# Altium schematic sheet CalibradorDePlacas_Microcontrolador.SchDoc
size A4
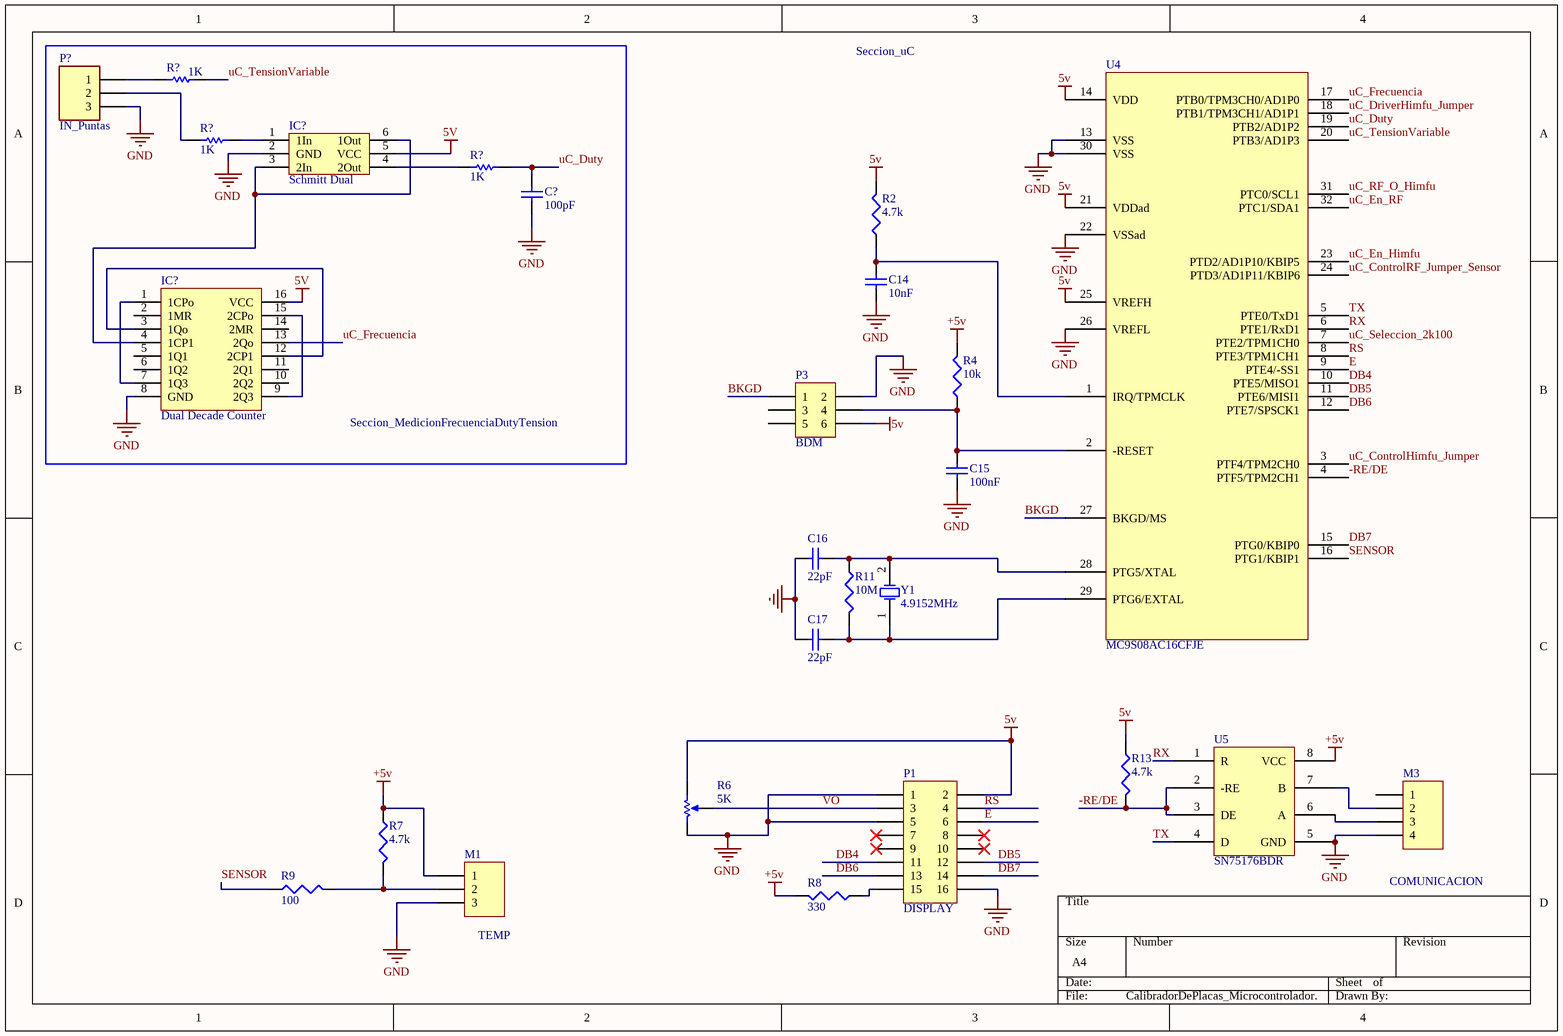
[diagram p0: CalibradorDePlacas_Microcontrolador.SchDoc]

## Parts
(Parts that share a designator on the sheet are numbered #1, #2 ... from top to bottom, then left to right.)
C14  10nF  [6-0805_M]
C15  100nF  [6-0805_M]
C16  22pF  [6-0805_M]
C17  22pF  [6-0805_M]
C?  100pF  [C_0805_3D]
IC?#1  Schmitt Dual  [TSOT23-6_3D]
IC?#2  Dual Decade Counter
M1  TEMP  [B3B-XH-A]
M3  COMUNICACION  [B4B-XH-A]
P1  DISPLAY  [HDR2X8]
P3  BDM  [SIP3*2]
P?  IN_Puntas  [B3B-XH-A_3D]
R2  4.7k  [6-0805_M]
R4  10k  [6-0805_M]
R6  5K  [PRESET 3386W]
R7  4.7k  [6-0805_M]
R8  330  [6-0805_M]
R9  100  [6-0805_M]
R11  10M  [6-0805_M]
R13  4.7k  [6-0805_M]
R?#1  1K  [R_0805_3D]
R?#2  1K  [R_0805_3D]
R?#3  1K  [R_0805_3D]
U4  MC9S08AC16CFJE  [QFP7x7-G32/Y1.45N]
U5  SN75176BDR  [SO8_L]
Y1  4.9152MHz  [XTAL_LOW]

## Blocks framed on the sheet
Seccion_MedicionFrecuenciaDutyTension: C? IC?#1 IC?#2 P? R?#1-R?#3

## Nets
5V: IC?#1.5(VCC) IC?#2.16(VCC) P1.2 P3.6 R2.2 R6.1(TOP) R13.1 U4.14(VDD) U4.21(VDDad) U4.25(VREFH)
+5v: M1.1 R4.2 R7.1 R8.2 U5.8(VCC)
GND: C14.1 C15.1 C16.1 C17.1 C?.1 IC?#1.2(GND) IC?#2.8(GND) M1.3 M3.4 P1.1 P1.5 P1.16 P3.2 P?.3 R6.3(BOT) U4.13(VSS) U4.22(VSSad) U4.26(VREFL) U4.30(VSS) U5.5(GND)
-RE/DE: R13.2 U4.4(PTF5/TPM2CH1) U5.2(-RE) U5.3(DE)
BKGD: P3.1 U4.27(BKGD/MS)
DB4: P1.11 U4.10(PTE5/MISO1)
DB5: P1.12 U4.11(PTE6/MISI1)
DB6: P1.13 U4.12(PTE7/SPSCK1)
DB7: P1.14 U4.15(PTG0/KBIP0)
E: P1.6 U4.9(PTE4/-SS1)
RS: P1.4 U4.8(PTE3/TPM1CH1)
RX: U4.6(PTE1/RxD1) U5.1(R)
SENSOR: R9.1 U4.16(PTG1/KBIP1)
TX: U4.5(PTE0/TxD1) U5.4(D)
uC_ControlHimfu_Jumper: U4.3(PTF4/TPM2CH0)
uC_ControlRF_Jumper_Sensor: U4.24(PTD3/AD1P11/KBIP6)
uC_DriverHimfu_Jumper: U4.18(PTB1/TPM3CH1/AD1P1)
uC_Duty: C?.2 R?#3.1 U4.19(PTB2/AD1P2)
uC_En_Himfu: U4.23(PTD2/AD1P10/KBIP5)
uC_En_RF: U4.32(PTC1/SDA1)
uC_Frecuencia: IC?#2.13(2Qo) U4.17(PTB0/TPM3CH0/AD1P0)
uC_RF_O_Himfu: U4.31(PTC0/SCL1)
uC_Seleccion_2k100: U4.7(PTE2/TPM1CH0)
uC_TensionVariable: R?#1.2 U4.20(PTB3/AD1P3)
VO: P1.3 R6.2(TAP)
NetC14_2: C14.2 R2.1 U4.1(IRQ/TPMCLK)
NetC15_2: C15.2 P3.4 R4.1 U4.2(-RESET)
NetC16_2: C16.2 R11.1 U4.28(PTG5/XTAL) Y1.2(OSC2)
NetC17_2: C17.2 R11.2 U4.29(PTG6/EXTAL) Y1.1(OSC1)
NetIC?#1_1: IC?#1.1(1In) R?#2.1
NetIC?#1_3: IC?#1.3(2In) IC?#1.6(1Out) IC?#2.4(1CP1)
NetIC?#1_4: IC?#1.4(2Out) R?#3.2
NetIC?#2_1: IC?#2.1(1CPo) IC?#2.7(1Q3)
NetIC?#2_3: IC?#2.3(1Qo) IC?#2.12(2CP1)
NetIC?#2_9: IC?#2.9(2Q3) IC?#2.15(2CPo)
NetM1_2: M1.2 R7.2 R9.2
NetM3_2: M3.2 U5.7(B)
NetM3_3: M3.3 U5.6(A)
NetP1_15: P1.15 R8.1
NetP?_1: P?.1 R?#1.1
NetP?_2: P?.2 R?#2.2

Not connected (* = marked no-connect by the designer): IC?#2 2(1MR) 5(1Q1) 6(1Q2) 10(2Q2) 11(2Q1) 14(2MR); M3 1; P1 7* 8* 9* 10*; P3 3 5

## Notes on the sheet
- Seccion_uC

## Library data of the parts
C14 = Cap: CAP CER 10000PF 50V 10% X7R 0805; Cod.Fabricante: C0805C103K5RACTU; Fabricante: Kemet; PackageReference: 6-0805_M; PackageDescription: Radial Cap, Thru-Hole; 2 Leads; 0.3 in Pin Spacing; Value: 10nF; Cod.Digikey: 399-1158-1-ND
C15 = Cap: CAP CER 0.1UF 50V 10% X7R 0805; Cod.Fabricante: C0805C104K5RACTU; Fabricante: Kemet; PackageReference: 6-0805_M; PackageDescription: Radial Cap, Thru-Hole; 2 Leads; 0.3 in Pin Spacing; Value: 100nF; Cod.Digikey: 399-1170-1-ND
C16 C17 = Cap: CAP CER 22PF 50V 5% NP0 0805; Cod.Fabricante: C0805C220J5GACTU; Fabricante: Kemet; PackageReference: 6-0805_M; PackageDescription: Radial Cap, Thru-Hole; 2 Leads; 0.3 in Pin Spacing; Value: 22pF; Cod.Digikey: 399-1113-1-ND
C? = C_0805_3D: Ceramic Chip Capacitor - Standard; Note: Footprint corresponds to dimensions for bulk cassette packaging. This case size has tightened tolerances.; Published: 17-Jul-2002; LatestRevisionDate: 19-Mar-2004; LatestRevisionNote: Silkscreen size reduced.; DatasheetDocument: Mar-2001; PackageDocument: Mar-2001; PackageReference: 0805; Publisher: Altium Limited; Code_JEITA: 0805; Code_IPC: 2012[0805]; ComponentLink1Description: Manufacturer Link; ComponentLink1URL: http://www.kemet.com/; ComponentLink2Description: Datasheet; ComponentLink2URL: http://www.kemet.com/kemet/web/homepage/kechome.nsf/vapubfilesname/F3102TA.pdf/$file/F3102TA.pdf; Cod.Digikey: *; Cod.Fabricante: *; Fabricante: *; Value: 100pF; Px100: *; DIGIKEYx100: *
IC?#1 = SN74L14: Inverter IC 2 Channel Schmitt Trigger SOT-23-6; Cod.Fabricante: SN74LVC2G14DBVR; Fabricante: Texas Instruments; Cod.DigiKey: 296-13010-1-ND; ComponentLink1Description: Manufacturer Link; ComponentLink1URL: http://www.ti.com/lit/ds/symlink/sn74lvc2g14.pdf; ComponentLink2Description: Datasheet; ComponentLink2URL: *; DatasheetVersion: O; DIGIKEYx100: 0.18790; LatestRevisionDate: *; LatestRevisionNote: *; PackageDescription: SOT-23-6; PackageReference: SOT-23-6; PackageVersion: *; Published: 29-sep-00; Publisher: Altium Limited; Value: *
IC?#2 = CD74HC390: Counter IC Counter, Decade 2 Element 4 Bit Negative Edge 16-SOIC; Cod.Fabricante: CD74HC390M96; Fabricante: Texas Instruments; Cod.DigiKey: 296-14526-1-ND; ComponentLink1Description: Manufacturer Link; ComponentLink1URL: http://www.ti.com/general/docs/suppproductinfo.tsp?distId=10&gotoUrl=http%3A%2F%2Fwww.ti.com%2Flit%2Fgpn%2Fcd74hc390; ComponentLink2Description: Datasheet; ComponentLink2URL: *; DatasheetVersion: *; DIGIKEYx100: 0.44560; LatestRevisionDate: *; LatestRevisionNote: *; PackageDescription: 16-SOIC; PackageReference: 16-SOIC; PackageVersion: *; Published: 29-sep-00; Publisher: Altium Limited; Value: *
M1 = Header 3: 3 Positions Header, Shrouded Connector 0.098" (2.50mm) Through Hole Tin; Value: B3B-XH-A(LF)(SN); Fabricante: JST Sales America Inc.; PackageReference: HDR1X3; PackageDescription: Conector 3 pines Macho polarizado; Cod.Digikey: 455-2248-ND; Cod.Fabricante: B3B-XH-A(LF)(SN)
M3 = Header 4: 4 Positions Header, Shrouded Connector 0.098" (2.50mm) Through Hole Tin; Value: B4B-XH-A(LF)(SN); Fabricante: JST Sales America Inc.; PackageReference: HDR1X4; PackageDescription: Conector 4 pines Macho polarizado; Cod.Digikey: 455-2249-ND; Cod.Fabricante: B4B-XH-A(LF)(SN)
P1 = Header 8X2: CONN HEADER VERT 16POS 2.54MM; Cod.Fabricante: M20-9980845; Fabricante: Harwin Inc; Value: M20-9980845; LatestRevisionDate: 17-Jul-2002; Publisher: Altium Limited; Cod.Digikey: 952-2553-ND; PackageReference: HDR2X8
P3 = CON3*2: DIL VERTICAL PC TAIL PIN HEADER; Cod.Fabricante: M20-9980345; Fabricante: Harwin Inc; Value: M20-9980345; Cod.Digikey: 952-2120-ND
P? = JST_2.5_3: CONN HEADER XH TOP 3POS 2.5MM; Cod.Fabricante: B3B-XH-A(LF)(SN); Fabricante: JST Sales America Inc.; LatestRevisionDate: 17-Jul-2002; LatestRevisionNote: Re-released for DXP Platform.; Publisher: Altium Limited; Cod.Digikey: 455-2248-ND; ComponentLink2Description: Datasheet; ComponentLink2URL: http://www.jst-mfg.com/product/pdf/eng/eXH.pdf; DIGIKEYx100: 0.1115
R2 R7 R13 = Res3: RES SMD 4.7K OHM 1% 1/8W 0805; Cod.Fabricante: RC0805FR-074K7L; Fabricante: Yageo; PackageReference: 6-0805_M; PackageDescription: Chip Resistor; Value: 4.7k; Cod.Digikey: 311-4.70KCRCT-ND
R4 = Res3: RES SMD 10K OHM 1% 1/8W 0805; Cod.Fabricante: RC0805FR-0710KL; Fabricante: Yageo; PackageReference: 6-0805_M; PackageDescription: Chip Resistor; Value: 10k; Cod.Digikey: 311-10.0KCRCT-ND
R6 = RPot: TRIMMER 5K OHM 0.5W PC PIN; Sim Note: Enter the Resistance value and the set point into parameter fields.; Set Position: 0.5; Cod.Fabricante: 3362M-1-502LF; Fabricante: Bourns Inc.; Published: 8-Jun-2000; LatestRevisionDate: 17-Jul-2002; LatestRevisionNote: Re-released for DXP Platform.; PackageReference: VR5; Publisher: Altium Limited; Value: 5K; Cod.Digikey: 3362M-502LF-ND ó 3386W-502LF-ND
R8 = Res3: RES SMD 330 OHM 1% 1/8W 0805; Cod.Fabricante: RC0805FR-07330RL; Fabricante: Yageo; PackageReference: 6-0805_M; PackageDescription: Chip Resistor; Value: 330; Cod.Digikey: 311-330CRCT-ND
R9 = Res3: RES SMD 100 OHM 1% 1/8W 0805; Cod.Fabricante: RC0805FR-07100RL; Fabricante: Yageo; PackageReference: 6-0805_M; PackageDescription: Chip Resistor; Value: 100; Cod.Digikey: 311-100CRCT-ND
R11 = Res3: RC0805FR-0710ML; Fabricante: Yageo; PackageReference: 6-0805_M; PackageDescription: Chip Resistor; Value: 10M; Cod.Digikey: 311-10.0MCRCT-ND; Cod.Fabricante: RC0805FR-0710ML
R?#1-R?#3 = R_0805_3D: RES SMD 1K OHM 1% 1/8W 0805; Cod.Fabricante: RC0805FR-071KL; Fabricante: Yageo; Published: 8-Jun-2000; LatestRevisionDate: 17-Jul-2002; LatestRevisionNote: Re-released for DXP Platform.; PackageReference: 0805; Publisher: Altium Limited; Cod.Digikey: 311-1.00KCRCT-ND; Value: 1K; DIGIKEYx100: 0.0088
U4 = Component_1: IC MCU 8BIT 16KB FLASH 32LQFP; Alternative: MC9S08AC16MFJE; Fabricante: Freescale Semiconductor - NXP; PackageReference: QFP7x7-G32/Y1.45N; Value: MC9S08AC16CFJE; PackageDescription: Microcontrolador; Cod.Digikey: MC9S08AC16CFJE-ND; Cod.Fabricante: MC9S08AC16CFJE
U5 = SN7517: IC DIFF BUS TXCVR 8-SOIC; Fabricante: Texas Instruments; PackageReference: SO8_L; Value: SN75176BDR; PackageDescription: Driver 485; Cod.Digikey: 296-1275-1-ND; Cod.Fabricante: SN75176BDR
Y1 = XTAL: 4.9152MHz ±30ppm Crystal 18pF 120 Ohm -40°C ~ 85°C Through Hole HC49/US; Cod.Fabricante: ATS049B-E ó ATS042; Fabricante: CTS-Frequency Controls; PackageReference: R38; PackageDescription: Crystal, Thru-Hole; 2 Leads; Body 3.1 x 8.2 mm (Dia.xH); Value: 4.9152MHz; Cod.Digikey: CTX914-ND ó CTX403-ND